# Altium schematic sheet bat_connectors.SchDoc
size A3; DocumentNumber: 14; SheetNumber: 14; SheetTotal: 15; SheetDescription: Connection to pack
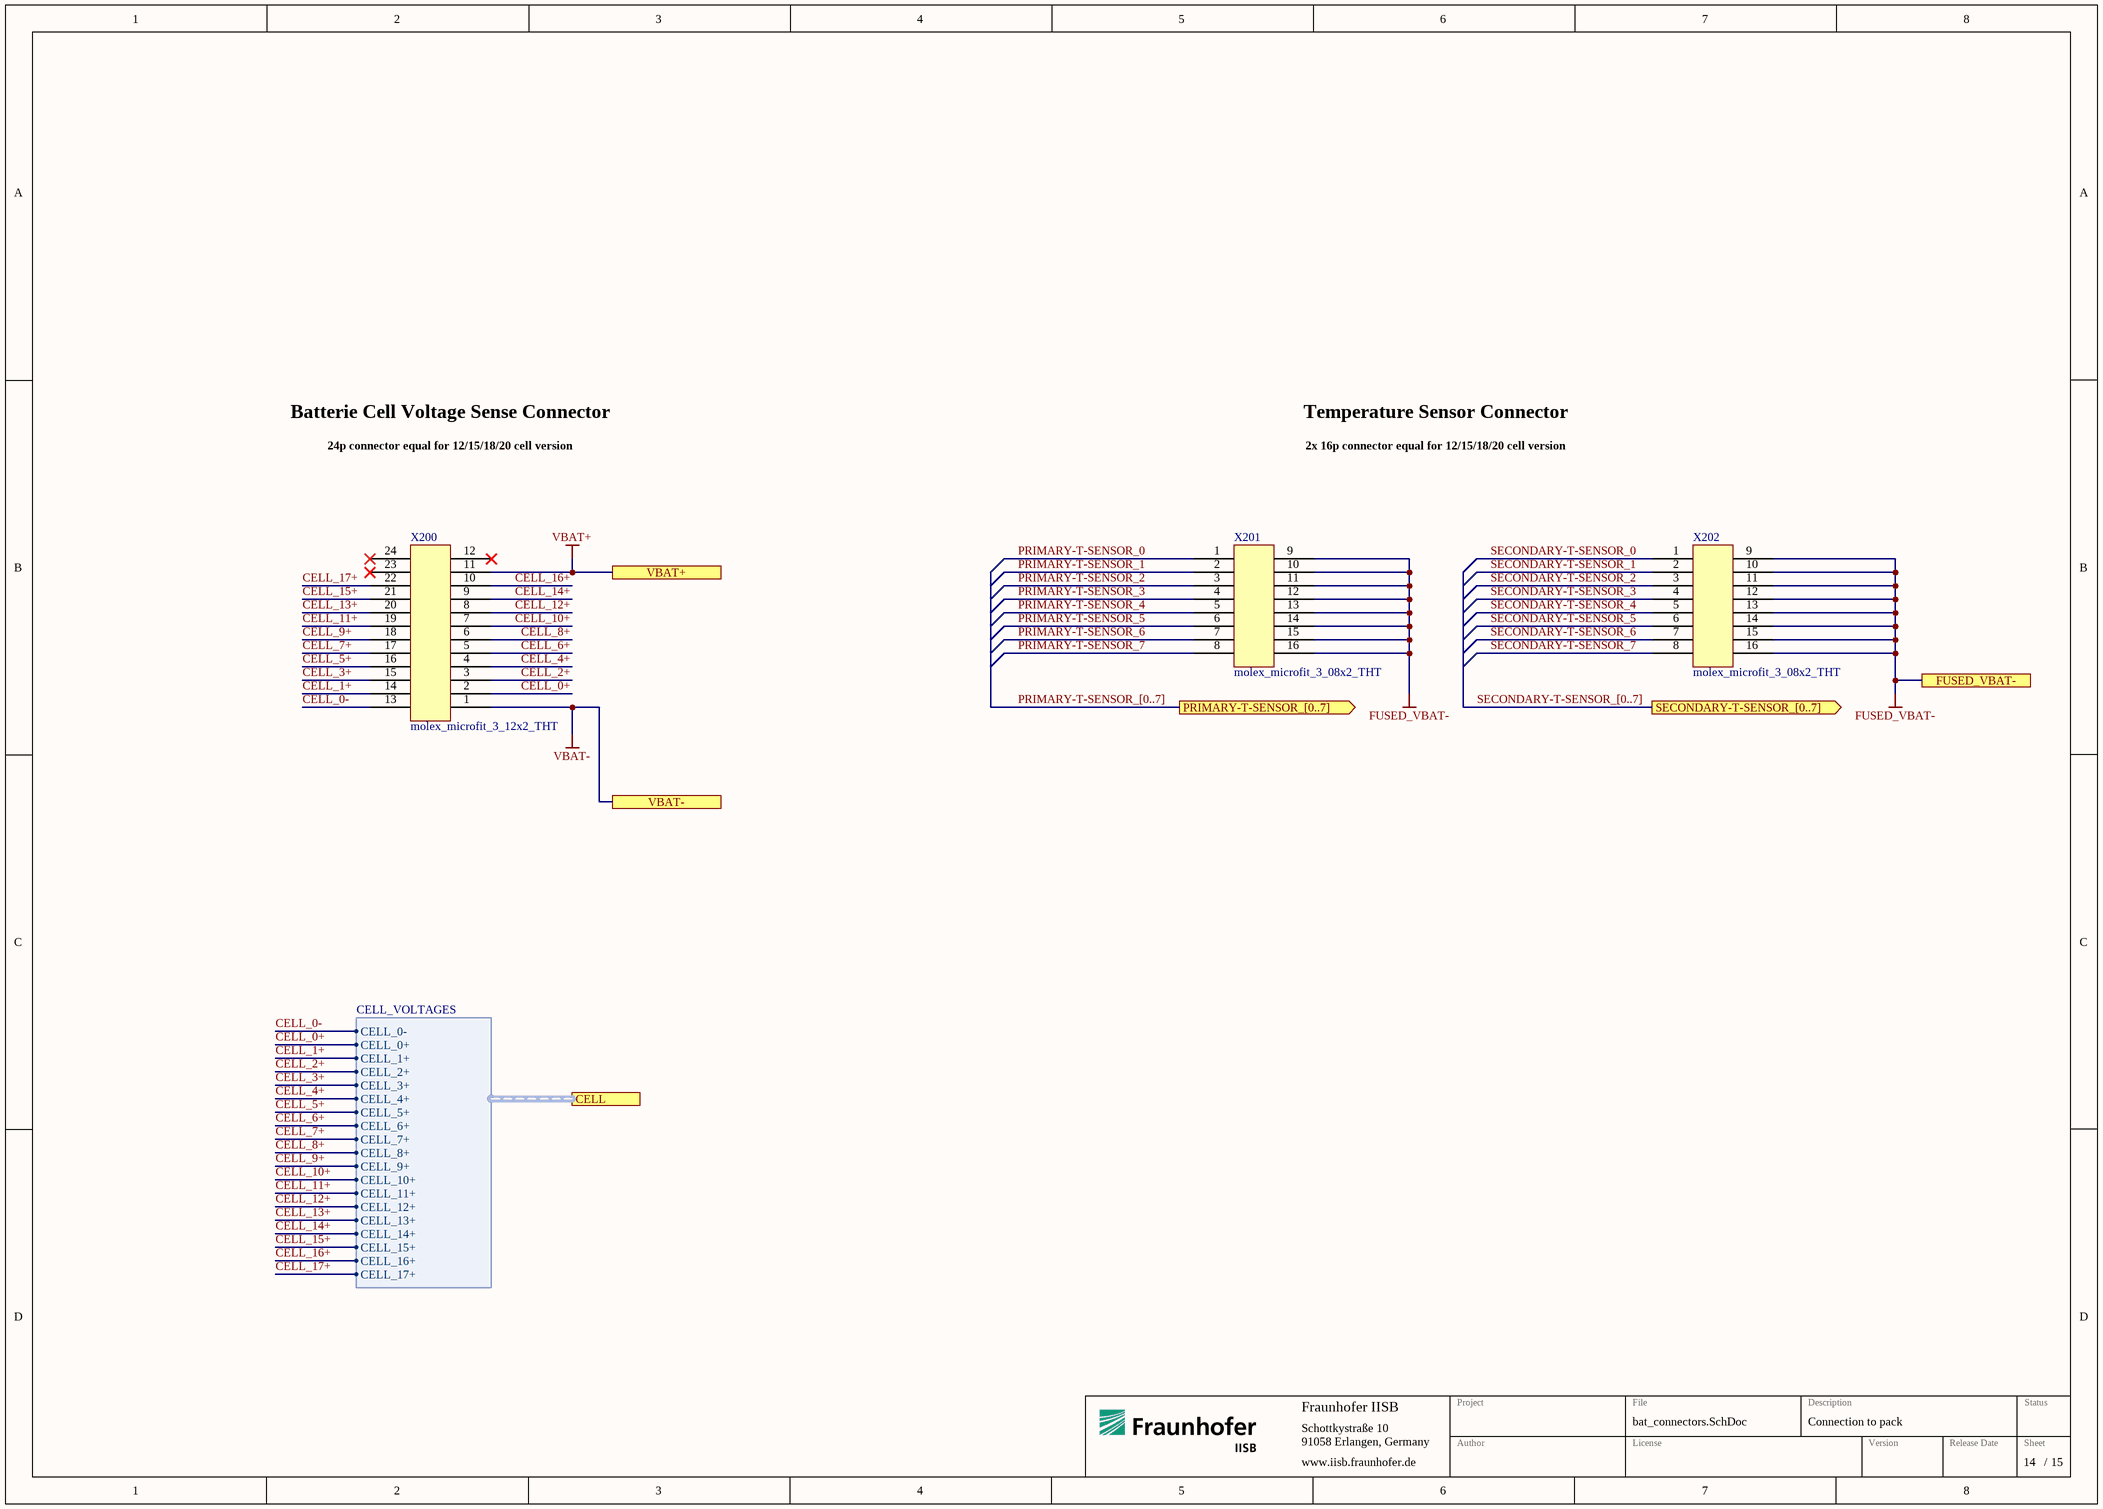
[diagram p0: bat_connectors.SchDoc]

## Parts
X200  molex_microfit_3_12x2_THT  [MOLEX_MICROFIT_12x2_THT]
X201  molex_microfit_3_08x2_THT  [MOLEX_MICROFIT_08x2_THT]
X202  molex_microfit_3_08x2_THT  [MOLEX_MICROFIT_08x2_THT]

## Ports
CELL (harness CELL_VOLTAGES), FUSED_VBAT-, PRIMARY-T-SENSOR_[0..7] (out), SECONDARY-T-SENSOR_[0..7] (out), VBAT+, VBAT-

## Harnesses
CELL_VOLTAGES: CELL_0-, CELL_0+, CELL_1+, CELL_2+, CELL_3+, CELL_4+, CELL_5+, CELL_6+, CELL_7+, CELL_8+, CELL_9+, CELL_10+, CELL_11+, CELL_12+, CELL_13+, CELL_14+, CELL_15+, CELL_16+, CELL_17+

## Nets
FUSED_VBAT-: X201.9 X201.10 X201.11 X201.12 X201.13 X201.14 X201.15 X201.16 X202.9 X202.10 X202.11 X202.12 X202.13 X202.14 X202.15 X202.16 ; port FUSED_VBAT-
VBAT+: X200.11 ; port VBAT+
VBAT-: X200.1 ; port VBAT-
CELL_0+: X200.2 ; port CELL.CELL_0+
CELL_0-: X200.13 ; port CELL.CELL_0-
CELL_1+: X200.14 ; port CELL.CELL_1+
CELL_2+: X200.3 ; port CELL.CELL_2+
CELL_3+: X200.15 ; port CELL.CELL_3+
CELL_4+: X200.4 ; port CELL.CELL_4+
CELL_5+: X200.16 ; port CELL.CELL_5+
CELL_6+: X200.5 ; port CELL.CELL_6+
CELL_7+: X200.17 ; port CELL.CELL_7+
CELL_8+: X200.6 ; port CELL.CELL_8+
CELL_9+: X200.18 ; port CELL.CELL_9+
CELL_10+: X200.7 ; port CELL.CELL_10+
CELL_11+: X200.19 ; port CELL.CELL_11+
CELL_12+: X200.8 ; port CELL.CELL_12+
CELL_13+: X200.20 ; port CELL.CELL_13+
CELL_14+: X200.9 ; port CELL.CELL_14+
CELL_15+: X200.21 ; port CELL.CELL_15+
CELL_16+: X200.10 ; port CELL.CELL_16+
CELL_17+: X200.22 ; port CELL.CELL_17+
PRIMARY-T-SENSOR_0: X201.1
PRIMARY-T-SENSOR_1: X201.2
PRIMARY-T-SENSOR_2: X201.3
PRIMARY-T-SENSOR_3: X201.4
PRIMARY-T-SENSOR_4: X201.5
PRIMARY-T-SENSOR_5: X201.6
PRIMARY-T-SENSOR_6: X201.7
PRIMARY-T-SENSOR_7: X201.8
SECONDARY-T-SENSOR_0: X202.1
SECONDARY-T-SENSOR_1: X202.2
SECONDARY-T-SENSOR_2: X202.3
SECONDARY-T-SENSOR_3: X202.4
SECONDARY-T-SENSOR_4: X202.5
SECONDARY-T-SENSOR_5: X202.6
SECONDARY-T-SENSOR_6: X202.7
SECONDARY-T-SENSOR_7: X202.8

Not connected (* = marked no-connect by the designer): X200 12* 23* 24*

## Buses and harness runs
bus PRIMARY-T-SENSOR_[0..7] = port PRIMARY-T-SENSOR_[0..7]
bus SECONDARY-T-SENSOR_[0..7] = port SECONDARY-T-SENSOR_[0..7]

## Notes on the sheet
- Batterie Cell Voltage Sense Connector
- 24p connector equal for 12/15/18/20 cell version
- Temperature Sensor Connector
- 2x 16p connector equal for 12/15/18/20 cell version
- Fraunhofer IISB
- Schottkystraße 10
- 91058 Erlangen, Germany
- Author
- Project
- License
- File
- Description
- Version
- Release Date
- Sheet
- Status
- www.iisb.fraunhofer.de
- /

## Library data of the parts
X200 = molex_microfit_3_12x2_THT: Micro-Fit 3.0 Right Angle Header, 3.00mm Pitch, Dual Row, 24 Circuits, with Snap-in Plastic Peg PCB Lock, Tin, Glow Wire Capable, Black, 43045-2400; Manufacturer: Molex; Circuits: 24; Rated Voltage: 600V; Rated Current: 8.5A; Automotive Qualified: False; Part Number: molex_microfit_3_12x2_THT; Part Name: MicroFit; Operating Temperature: -40°C - +105°C; Supplier 1: Farnell; Supplier Part Number 1: 1012245
X201 X202 = molex_microfit_3_08x2_THT: Micro-Fit 3.0 Right Angle Header, 3.00mm Pitch, Dual Row, 16 Circuits, with Snap-in Plastic Peg PCB Lock, Tin, Glow Wire Capable, Black, 43045-1600; Manufacturer: Molex; Circuits: 16; Rated Voltage: 600V; Rated Current: 8.5A; Automotive Qualified: False; Part Number: molex_microfit_3_08x2_THT; Part Name: MicroFit; Operating Temperature: -40°C - +105°C; Supplier 1: Farnell; Supplier Part Number 1: 9961380